# EAGLE design encore Control Board (EAGLE 9.6.2)
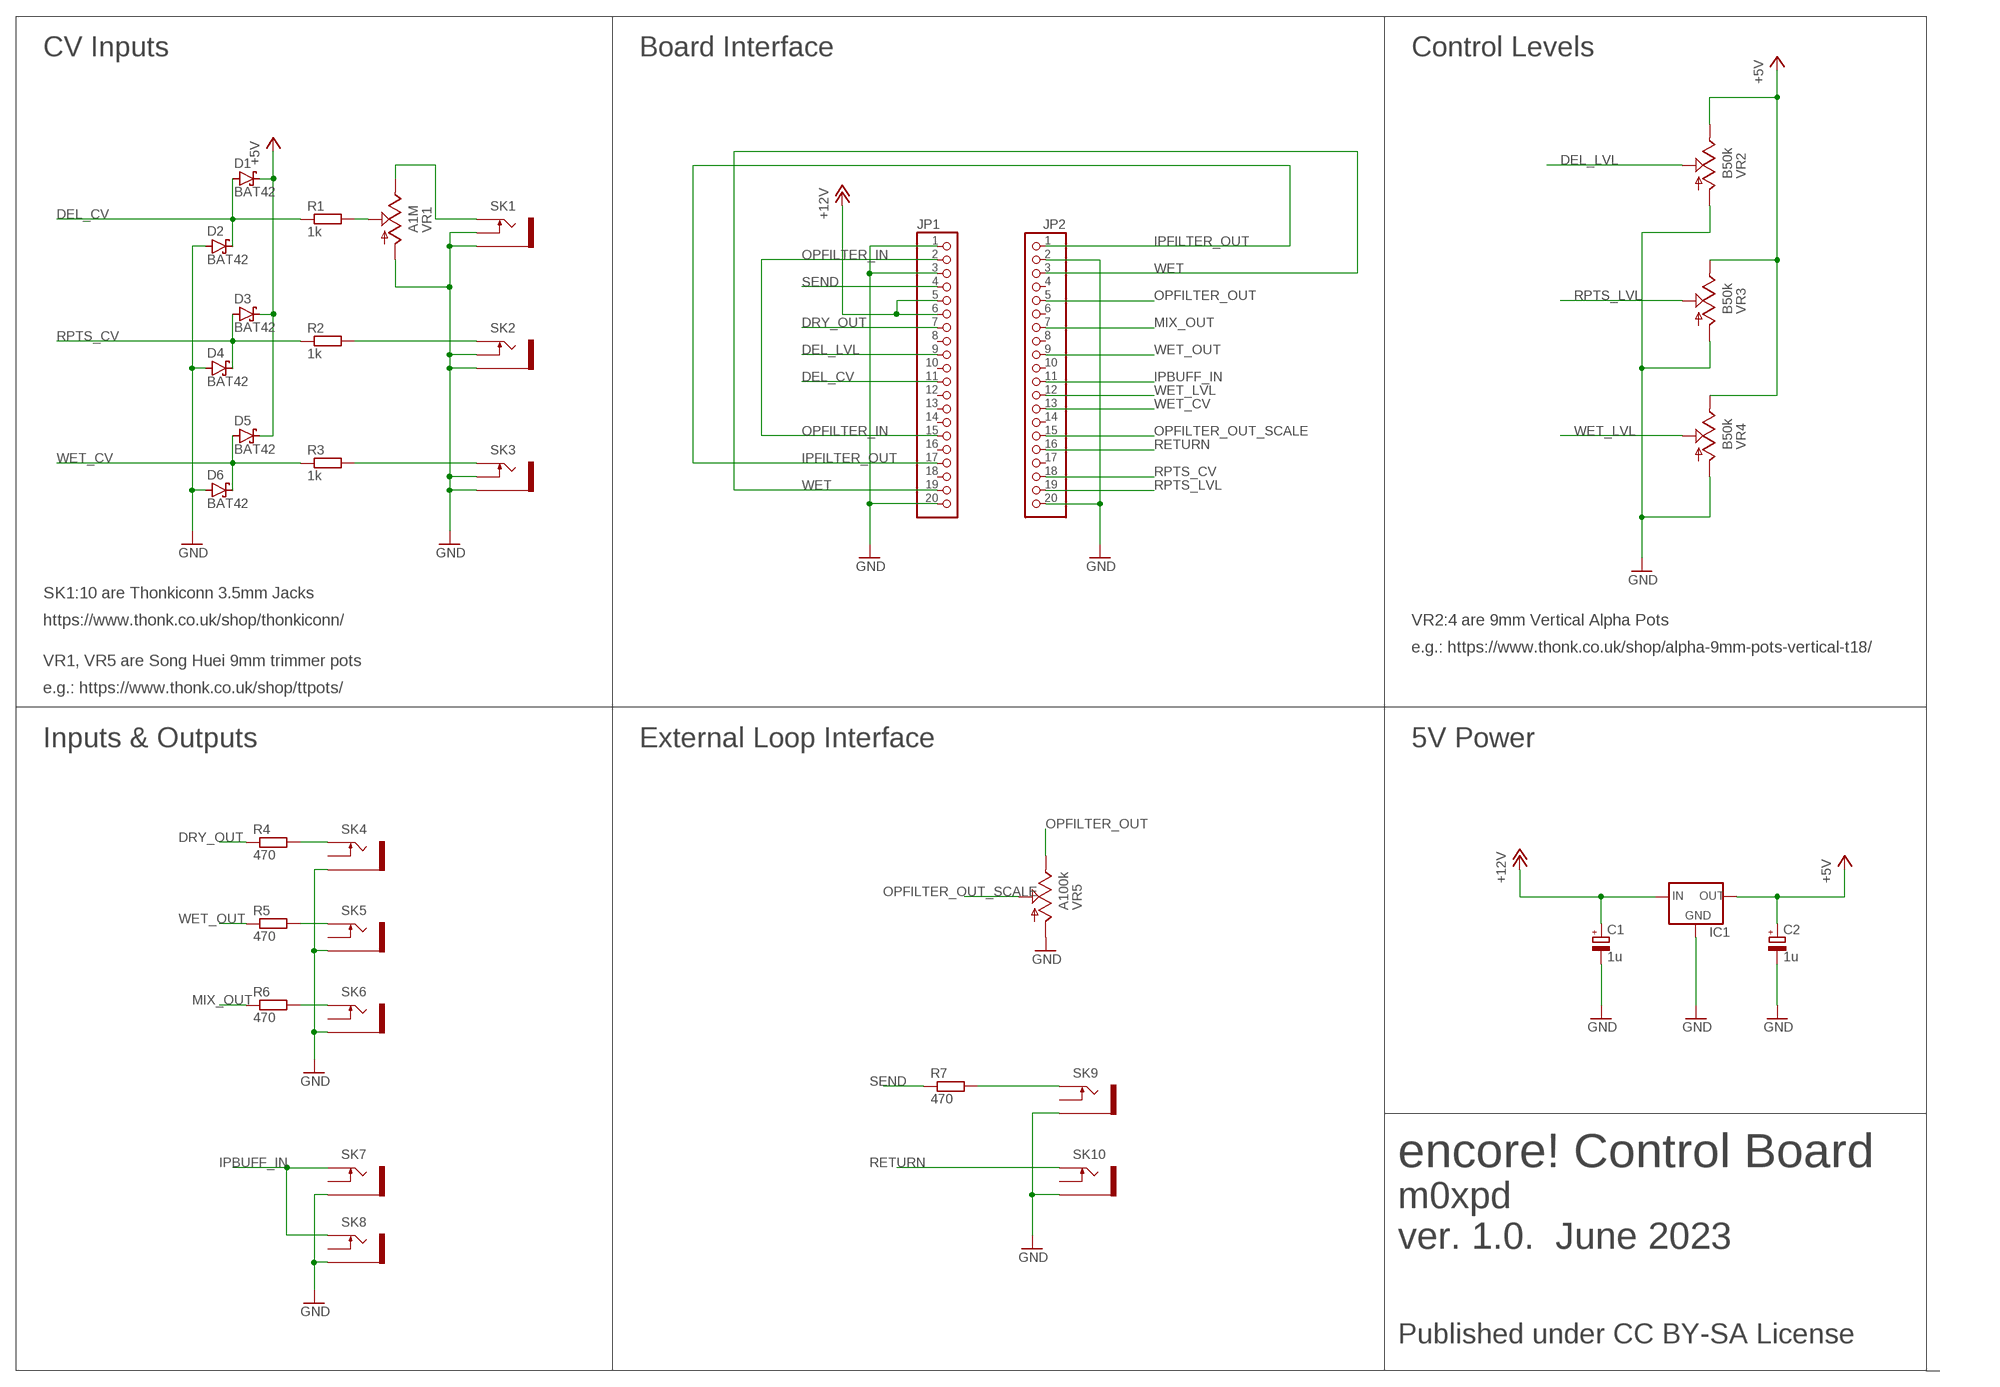
[diagram p0: schematic, sheet 1]

## Parts
C1  1u  CPOL-EUE2.5-5  [E2,5-5]
C2  1u  CPOL-EUE2.5-5  [E2,5-5]
D1  BAT42  [DO35-10]
D2  BAT42  [DO35-10]
D3  BAT42  [DO35-10]
D4  BAT42  [DO35-10]
D5  BAT42  [DO35-10]
D6  BAT42  [DO35-10]
IC1  78LXX  [78LXX]
JP1  PINHD-1X20  [1X20]
JP2  PINHD-1X20  [1X20]
R1  1k  R-EU_0204/7  [0204/7]
R2  1k  R-EU_0204/7  [0204/7]
R3  1k  R-EU_0204/7  [0204/7]
R4  470  R-EU_0204/7  [0204/7]
R5  470  R-EU_0204/7  [0204/7]
R6  470  R-EU_0204/7  [0204/7]
R7  470  R-EU_0204/7  [0204/7]
SK1  THONKICONN_JACK  [WQP-PJ301M-12_JACK]
SK2  THONKICONN_JACK  [WQP-PJ301M-12_JACK]
SK3  THONKICONN_JACK  [WQP-PJ301M-12_JACK]
SK4  THONKICONN_JACK  [WQP-PJ301M-12_JACK]
SK5  THONKICONN_JACK  [WQP-PJ301M-12_JACK]
SK6  THONKICONN_JACK  [WQP-PJ301M-12_JACK]
SK7  THONKICONN_JACK  [WQP-PJ301M-12_JACK]
SK8  THONKICONN_JACK  [WQP-PJ301M-12_JACK]
SK9  THONKICONN_JACK  [WQP-PJ301M-12_JACK]
SK10  THONKICONN_JACK  [WQP-PJ301M-12_JACK]
VR1  A1M  9MM_SNAP-IN_POT_  [9MM_SNAP-IN_POT]
VR2  B50k  9MM_SNAP-IN_POT_  [9MM_SNAP-IN_POT]
VR3  B50k  9MM_SNAP-IN_POT_  [9MM_SNAP-IN_POT]
VR4  B50k  9MM_SNAP-IN_POT_  [9MM_SNAP-IN_POT]
VR5  A100k  9MM_SNAP-IN_POT_  [9MM_SNAP-IN_POT]

## Nets
+5V: C2.+ D1.C D3.C D5.C IC1.OUT VR2.3(E) VR3.3(E) VR4.3(E)
+12V: C1.+ IC1.IN JP1.5 JP1.6
DEL_CV: D1.A D2.C JP1.11 R1.1
DEL_LVL: JP1.9 VR2.2(S)
DRY_OUT: JP1.7 R4.1
GND: C1.- C2.- D2.A D4.A D6.A IC1.GND JP1.1 JP1.3 JP1.20 JP2.2 JP2.20 SK1.P$2_SWITCH(SWITCH) SK1.P$3_SLEEVE(SLEEVE) SK2.P$2_SWITCH(SWITCH) SK2.P$3_SLEEVE(SLEEVE) SK3.P$2_SWITCH(SWITCH) SK3.P$3_SLEEVE(SLEEVE) SK4.P$3_SLEEVE(SLEEVE) SK5.P$3_SLEEVE(SLEEVE) SK6.P$3_SLEEVE(SLEEVE) SK7.P$3_SLEEVE(SLEEVE) SK8.P$3_SLEEVE(SLEEVE) SK9.P$3_SLEEVE(SLEEVE) SK10.P$3_SLEEVE(SLEEVE) VR1.1(A) VR2.1(A) VR3.1(A) VR4.1(A) VR5.1(A)
IPBUFF_IN: JP2.11 SK7.P$1_TIP(TIP) SK8.P$1_TIP(TIP)
IPFILTER_OUT: JP1.17 JP2.1
MIX_OUT: JP2.7 R6.1
N$2: R4.2 SK4.P$1_TIP(TIP)
N$3: R5.2 SK5.P$1_TIP(TIP)
N$4: R6.2 SK6.P$1_TIP(TIP)
N$9: R7.2 SK9.P$1_TIP(TIP)
N$15: SK1.P$1_TIP(TIP) VR1.3(E)
N$17: R2.2 SK2.P$1_TIP(TIP)
N$18: R3.2 SK3.P$1_TIP(TIP)
N$19: R1.2 VR1.2(S)
OPFILTER_IN: JP1.2 JP1.15
OPFILTER_OUT: JP2.5 VR5.3(E)
OPFILTER_OUT_SCALE: JP2.15 VR5.2(S)
RETURN: JP2.16 SK10.P$1_TIP(TIP)
RPTS_CV: D3.A D4.C JP2.18 R2.1
RPTS_LVL: JP2.19 VR3.2(S)
SEND: JP1.4 R7.1
WET: JP1.19 JP2.3
WET_CV: D5.A D6.C JP2.13 R3.1
WET_LVL: JP2.12 VR4.2(S)
WET_OUT: JP2.9 R5.1
Unconnected: JP1.8 JP1.10 JP1.12 JP1.13 JP1.14 JP1.16 JP1.18 JP2.4 JP2.6 JP2.8 JP2.10 JP2.14 JP2.17 SK4.P$2_SWITCH(SWITCH) SK5.P$2_SWITCH(SWITCH) SK6.P$2_SWITCH(SWITCH) SK7.P$2_SWITCH(SWITCH) SK8.P$2_SWITCH(SWITCH) SK9.P$2_SWITCH(SWITCH) SK10.P$2_SWITCH(SWITCH)

## Notes on the sheet
- CV Inputs | Board Interface | Control Levels
- SK1:10 are Thonkiconn 3.5mm Jacks
- https://www.thonk.co.uk/shop/thonkiconn/ | VR2:4 are 9mm Vertical Alpha Pots
- e.g.: https://www.thonk.co.uk/shop/alpha-9mm-pots-vertical-t18/
- VR1, VR5 are Song Huei 9mm trimmer pots
- e.g.: https://www.thonk.co.uk/shop/ttpots/
- Inputs & Outputs | External Loop Interface | 5V Power
- encore! Control Board
- m0xpd
- ver. 1.0.  June 2023
- Published under CC BY-SA License

## Library data of the parts
C1 C2 = rcl:CPOL-EU: POLARIZED CAPACITOR, European symbol; SPICEPREFIX: C
D1-D6 = diode:BAT42: DIODE barrier diode
IC1 = v-reg:78LXX: VOLTAGE REGULATOR
JP1 JP2 = pinhead:PINHD-1X20: PIN HEADER
R1-R7 = rcl:R-EU_: RESISTOR, European symbol; SPICEPREFIX: R
SK1-SK10 = MyLibrary:THONKICONN_JACK
VR1-VR5 = MusicThingModular:9MM_SNAP-IN_POT: 9mm vertical snap-in pot, Alpha / Panasonic style

## Board
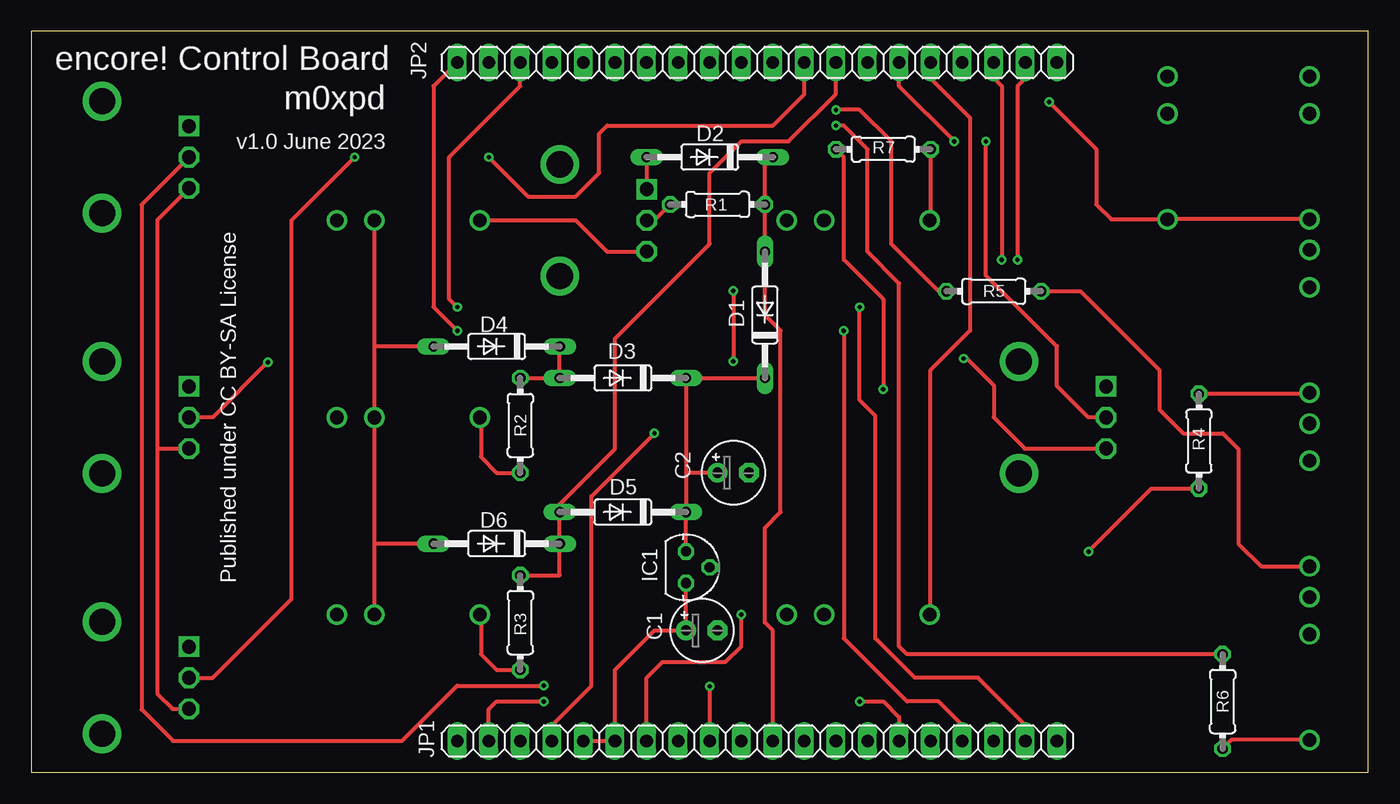
[diagram p1: board, top side]
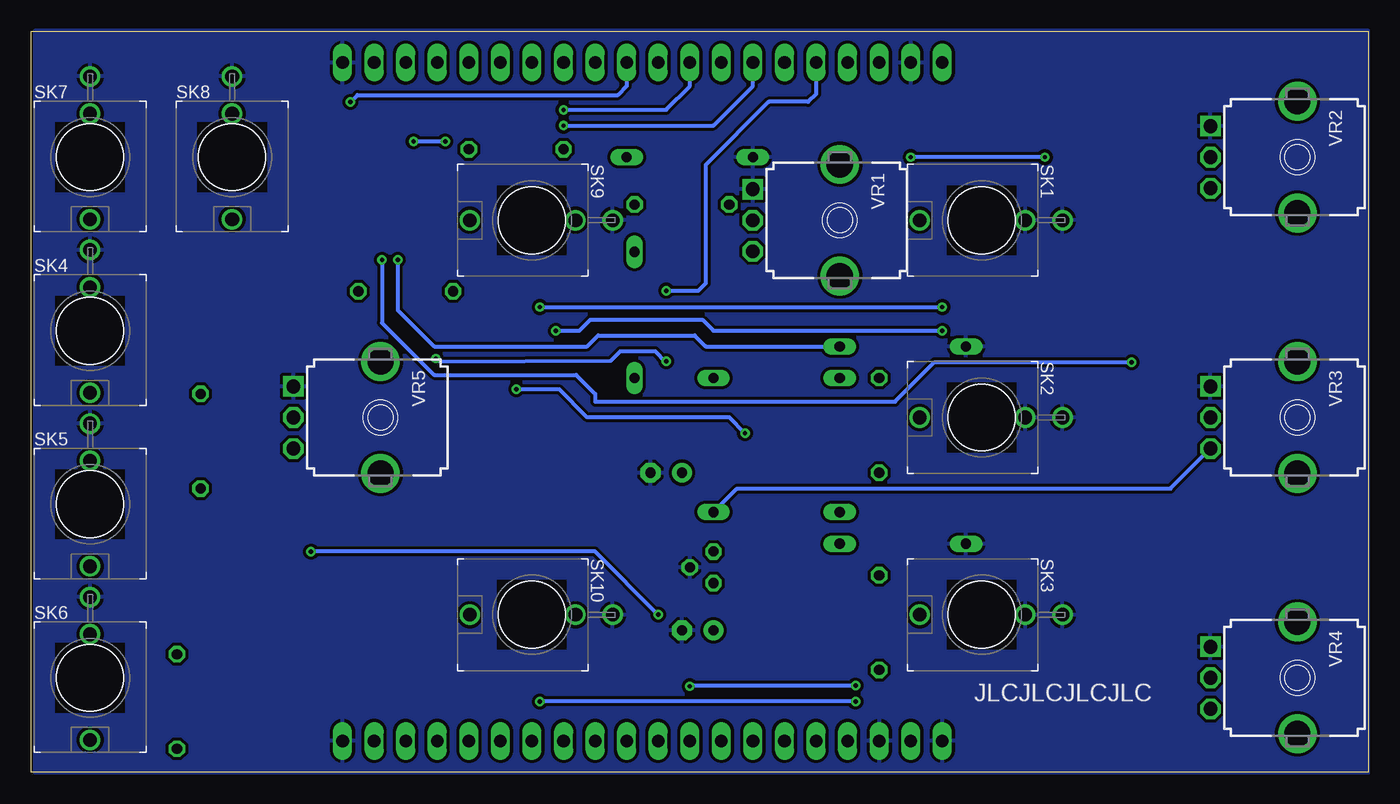
[diagram p2: board, bottom side, seen from below]

Size 107.62 x 59.68 mm. Coordinates in mm from the lower left corner, seen from the top.
Outline: 0,0 107.62,0 107.62,59.68 0,59.68 0,0
Copper layers (1*16): Top 0.035mm / dielectric 1.5mm / Bottom 0.035mm
Design rules "default *": minimum track width 6mil, minimum drill 0.35mm, track to track 10mil, track to pad 10mil, pad to pad 6mil, via to via 6mil, smd to smd 6mil, copper to edge 0mil, drill to drill 6mil, minimum pad ring 10mil, minimum via ring 8mil, stop-mask expansion 4mil, vias tented up to drill 0mil, thermal gap 10mil

### Footprints (pad centres in the part's own frame; a part is rotated, then mirrored left to right if it is on the bottom)
E2,5-5 = drill 0.813 pad 1.6: + -1.27,0 | drill 0.813 pad 1.6 octagon: - 1.27,0
DO35-10 = drill 0.813 long: A 5.08,0; C -5.08,0
78LXX = drill 0.813 octagon: GND 0,1.905; IN 1.27,0; OUT -1.27,0
1X20 = drill 1.016 long: 1 -24.13,0; 2 -21.59,0; 3 -19.05,0; 4 -16.51,0; 5 -13.97,0; 6 -11.43,0; 7 -8.89,0; 8 -6.35,0; 9 -3.81,0; 10 -1.27,0; 11 1.27,0; 12 3.81,0; 13 6.35,0; 14 8.89,0; 15 11.43,0; 16 13.97,0; 17 16.51,0; 18 19.05,0; 19 21.59,0; 20 24.13,0
0204/7 = drill 0.813 octagon: 1 -3.81,0; 2 3.81,0
WQP-PJ301M-12_JACK = drill 1.1: P$1_TIP 0,5; P$2_SWITCH 0,-3.5; P$3_SLEEVE 0,-6.5
9MM_SNAP-IN_POT = drill 1.1 square: 1 -2.5,-7 | drill 1.1 octagon: 2 0,-7; 3 2.5,-7 | drill 2.1 pad 2.794: CHASSIS1 -4.5,0; CHASSIS2 4.5,0

### Placement (x,y rotation side)
C1  53.98,11.43 0 top
C2  56.52,24.13 0 top
D1  59.05,36.83 90 top
D2  54.61,49.53 180 top
D3  47.62,31.75 180 top
D4  37.47,34.29 180 top
D5  47.62,20.95 180 top
D6  37.47,18.41 180 top
IC1  52.7,16.51 270 top
JP1  58.42,2.54 0 top
JP2  58.42,57.15 0 top
R1  55.24,45.72 180 top
R2  39.37,27.94 270 top
R3  39.37,12.06 270 top
R4  93.98,26.67 90 top
R5  77.47,38.73 0 top
R6  95.89,5.71 270 top
R7  68.58,50.16 0 top
SK1  31.11,44.45 90 bottom
SK2  31.11,28.57 90 bottom
SK3  31.11,12.7 90 bottom
SK4  102.87,35.56 180 bottom
SK5  102.87,21.59 180 bottom
SK6  102.87,7.62 180 bottom
SK7  102.87,49.53 180 bottom
SK8  91.44,49.53 180 bottom
SK9  67.31,44.45 90 bottom
SK10  67.31,12.7 90 bottom
VR1  42.55,44.45 270 bottom
VR2  5.71,49.53 270 bottom
VR3  5.71,28.57 270 bottom
VR4  5.71,7.62 270 bottom
VR5  79.5,28.57 270 bottom

### Tracks (layer width: path | path; a pad name or v marks a point on that pad's centre or on a via)
+5V
  Top 0.305: VR2.3 10.16,44.48 10.16,26.04 | VR4.3 11.39,5.12 10.16,6.35 10.16,26.04 | VR3.3 12.68,26.04 10.16,26.04 | 52.7,24.13 D3.C D1.C | 52.7,24.13 D5.C IC1.OUT | C2.+ 52.7,24.13
  Bottom 0.305: D5.C 50.8,22.86 15.93,22.86 VR3.3
+12V
  Top 0.305: IC1.IN C1.+ 50.16,11.43 46.99,8.26 JP1.6 JP1.5
DEL_CV
  Top 0.305: JP1.11 59.69,11.43 59.05,12.06 59.05,19.68 60.33,20.95 60.33,35.56 59.05,36.83 D1.A R1.1 59.05,48.9 D2.C
DEL_LVL  (via drill 0.35)
  Top 0.305: VR2.2 8.89,45.7 8.89,5.08 11.43,2.54 29.84,2.54 34.29,6.99 v41.27,6.99 | v54.61,6.94 JP1.9
  Bottom 0.305: v41.27,6.99 54.61,6.99 v54.61,6.94
DRY_OUT  (via drill 0.35)
  Top 0.305: JP1.7 49.53,7.62 50.8,8.89 55.88,8.89 57.15,10.16 v57.15,12.7 | R4.1 90.17,22.86 v85.09,17.78
  Bottom 0.305: v57.15,12.7 62.23,17.78 v85.09,17.78
GND
  Top 0.305: D2.A 49.53,46.95 VR1.1 | SK1.P$2_SWITCH 27.61,34.29 | 27.61,34.29 SK2.P$2_SWITCH 27.61,18.41 | 27.61,18.41 SK3.P$2_SWITCH | D4.A 27.61,34.29 | D6.A 27.61,18.41
  pour Bottom: 0,0 0,59.69 107.31,59.69 107.31,0
IPBUFF_IN  (via drill 0.35)
  Top 0.305: SK7.P$1_TIP SK8.P$1_TIP 86.92,44.53 85.72,45.72 85.72,50.16 v81.92,53.98
  Bottom 0.305: JP2.11 59.69,55.24 60.41,54.53 81.36,54.53 v81.92,53.98
IPFILTER_OUT  (via drill 0.35)
  Top 0.305: JP1.17 74.93,3.81 73.03,5.71 70.48,5.71 65.41,10.79 v65.41,35.56 | JP2.1 32.38,55.24 32.38,37.47 v34.29,35.56
  Bottom 0.305: v65.41,35.56 63.5,35.56 62.61,36.45 53.59,36.45 52.7,35.56 v34.29,35.56
MIX_OUT  (via drill 0.35)
  Top 0.305: R6.1 70.48,9.53 69.85,10.16 69.85,39.37 67.31,41.91 67.31,50.16 65.41,52.07 v64.77,52.07
  Bottom 0.305: JP2.7 49.53,55.24 52.7,52.07 v64.77,52.07
N$2
  Top 0.152: SK4.P$1_TIP 102.79,30.48
  Top 0.305: 102.79,30.48 R4.2
N$3
  Top 0.305: R5.2 84.45,38.73 90.81,32.38 90.81,29.21 92.71,27.3 95.89,27.3 97.16,26.04 97.16,18.41 98.98,16.59 SK5.P$1_TIP
N$4
  Top 0.305: SK6.P$1_TIP 96.6,2.62 R6.2
N$9
  Top 0.305: R7.2 72.39,44.53 SK9.P$1_TIP
N$15
  Top 0.305: SK1.P$1_TIP 43.81,44.45 46.35,41.91 49.51,41.91 VR1.3
N$17
  Top 0.305: SK2.P$1_TIP 36.2,28.5 36.2,25.4 37.47,24.13 R2.2
N$18
  Top 0.305: SK3.P$1_TIP 36.2,12.62 36.2,9.53 37.47,8.26 R3.2
N$19
  Top 0.305: R1.2 50.16,44.45 VR1.2
OPFILTER_IN  (via drill 0.35)
  Top 0.305: JP1.2 36.83,5.08 37.47,5.71 v41.27,5.71 | v66.67,5.71 68.58,5.71 69.85,4.45 JP1.15
  Bottom 0.305: v41.27,5.71 v66.67,5.71
OPFILTER_OUT  (via drill 0.35)
  Top 0.305: v75.06,33.32 75.31,33.32 77.47,31.16 77.47,28.57 79.97,26.07 VR5.3 | v56.52,38.78 v56.52,33.1
  Bottom 0.305: JP2.5 44.45,54.61 45.09,53.98 48.26,53.98 53.34,48.9 53.34,39.37 53.93,38.78 v56.52,38.78 | v56.52,33.1 56.59,33.1 57.4,33.91 60.2,33.91 60.96,33.15 74.75,33.1 74.85,33.2 74.93,33.2 v75.06,33.32
OPFILTER_OUT_SCALE  (via drill 0.35)
  Top 0.305: VR5.2 85.09,28.57 82.55,31.11 82.55,34.29 76.83,40.01 v76.83,50.8 | JP2.15 69.85,55.24 v74.3,50.8
  Bottom 0.305: v76.83,50.8 v74.3,50.8
RETURN
  Top 0.152: SK10.P$1_TIP 72.39,12.78
  Top 0.305: JP2.16 72.39,55.88 75.56,52.7 75.56,35.56 72.39,32.38 72.39,12.78
  Bottom 0.305: 72.39,12.78 SK10.P$1_TIP
RPTS_CV  (via drill 0.35)
  Top 0.305: R2.1 D3.A D4.C | JP2.18 77.47,55.88 78.11,55.24 v78.11,41.27
  Bottom 0.305: D4.C 53.34,34.29 54.23,35.18 61.98,35.18 62.87,34.29 75.18,34.29 78.11,37.21 v78.11,41.27
RPTS_LVL  (via drill 0.35)
  Top 0.305: JP2.19 80.01,55.88 79.38,55.24 v79.38,41.27 | v19.05,33.02 14.61,28.57 VR3.2
  Bottom 0.305: v79.38,41.27 79.38,36.2 75.18,32 63.75,32 62.23,30.48 62.23,29.84 38.1,29.84 34.92,33.02 v19.05,33.02
SEND  (via drill 0.35)
  Top 0.305: JP1.4 41.91,3.81 45.09,6.99 45.09,22.23 v50.16,27.3 | v68.58,30.86 68.58,38.1 65.41,41.27 65.41,49.53 R7.1
  Bottom 0.305: v50.16,27.3 51.44,28.57 62.87,28.57 65.15,30.86 v68.58,30.86
WET  (via drill 0.35)
  Top 0.305: JP1.19 80.01,3.81 76.2,7.62 71.12,7.62 67.94,10.79 67.94,28.7 66.67,29.97 v66.67,37.47 | v34.29,37.47 33.66,38.1 33.66,49.53 39.37,55.24 JP2.3
  Bottom 0.305: v66.67,37.47 v34.29,37.47
WET_CV
  Top 0.305: R3.1 42.55,15.88 D6.C D5.A 42.55,21.59 46.99,26.04 46.99,34.92 54.61,42.55 54.61,48.26 57.15,50.8 60.96,50.8 64.77,54.61 JP2.13
WET_LVL  (via drill 0.35)
  Top 0.305: VR4.2 14.61,7.62 20.95,13.97 20.95,44.45 v26.04,49.53 | v36.83,49.53 40.01,46.35 43.81,46.35 45.72,48.26 45.72,51.44 46.35,52.07 59.69,52.07 62.23,54.61 JP2.12
  Bottom 0.305: v26.04,49.53 v36.83,49.53
WET_OUT  (via drill 0.35)
  Top 0.305: R5.1 73.03,38.73 69.22,42.55 69.22,50.8 66.67,53.34 v64.77,53.34
  Bottom 0.305: v64.77,53.34 56.52,53.34 54.61,55.24 JP2.9

### Text on the board
tNames: encore! Control Board | m0xpd | v1.0 June 2023 | Published under CC BY-SA License
bNames: JLCJLCJLCJLC